# Altium project Module_Input_BME280.PrjPcb
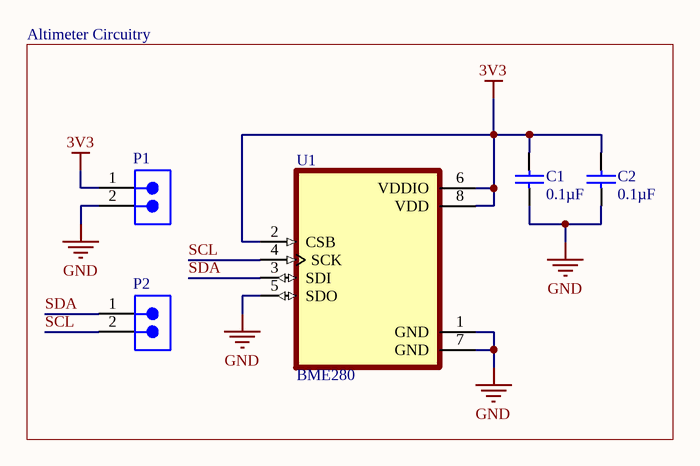
[diagram p0: Schematic.SchDoc]
1 sheet, 5 parts. Net scope: global (net labels, ports and power ports of the same name join across sheets).
Board file: PCB.PcbDoc

## Sheet Schematic.SchDoc
size A; SheetNumber: 1; SheetTotal: 1

### Parts
C1  0.1µF  [CAPC3216X100X50LL20T25]
C2  0.1µF  [CAPC3216X100X50LL20T25]
P1  61300211121  [61300211121]  (value not drawn)
P2  61300211121  [61300211121]  (value not drawn)
U1  BME280  [PSON65P250X250X100-8N]

### Blocks framed on the sheet
Altimeter Circuitry: C1 C2 P1 P2 U1

### Nets
3V3: C1.1 C2.1 P1.1 U1.2(CSB) U1.6(VDDIO) U1.8(VDD)
GND: C1.2 C2.2 P1.2 U1.1(GND) U1.5(SDO) U1.7(GND)
SCL: P2.2 U1.4(SCK)
SDA: P2.1 U1.3(SDI)

### Library data of the parts
C1 C2 = CMP-1664-00001-4: Chip Capacitor, 100 nF, +/- 10%, 25 V, -55 to 125 degC, 1206 (3216 Metric), RoHS, Tape and Reel; Manufacturer: Kemet; Voltage Rating: 25 V; ComponentLink1URL: http://www.kemet.com/; Max Operating Temperature: 125 degC; PackageReference: 1206; ComponentLink2URL: http://www.kemet.com/docfinder?Partnumber=C1206F104K3RACTU; ComponentLink1Description: Manufacturer URL; ComponentLink2Description: Datasheet; Length: 3.2 mm; Packaging: Tape and Reel; Height: 0.78 mm; Mounting Technology: Surface Mount; REACH SVHC: No SVHC; PackageDescription: 2-Pin Surface Mount Device, Body 3.2 x 1.6 mm; Min Operating Temperature: -55 degC; RoHSCompliant: true; DatasheetVersion: 02/2016; Package Quantity: 4000
P1 P2 = CMP-1712-00002-6: NexarPartId: 20081794; Number of Contacts: 2; Pitch: 2.54mm; Connector Type: Male Pin; Voltage Rating: 250V; Current Rating: 3A; Gender: Male; Contact Resistance: 20mΩ; Height: 8.94mm; Lead Free: Lead Free; Number of Pins: 2; Termination: Through Hole; RoHS: Compliant; Lead Pitch: 2.54mm; REACH SVHC: No SVHC; Housing Material: PBT; Contact Mating Length: 5.9944mm; Min Operating Temperature: -40°C; Orientation: Vertical; Contact Material: Copper; Contact Gender: Male; Max Operating Temperature: 125°C; Number of Rows: 1; Number of Positions: 2; Packaging: Bulk; Contact Plating: Gold; Mount: Through Hole; Color: Black; Operating Supply Voltage: 250V
U1 = BME280: DIGITAL HUMIDITY, PRESSURE AND TEMPERATURE SENSOR<br>* Digital interface IÂ²C (up to 3.4 MHz) and SPI (3 and 4 wire, up to 10 MHz)* Supply voltage VDD main supply voltage range: 1.71 V to 3.6 V*VDDIO interface voltage range: 1.2 V to 3.6 V<br> Operating range -40â€¦+85 Â°C, 0â€¦100 % rel. humidity, 300â€¦1100 hPa <br><br>  The library has been designed by<a href="https://www.facebook.com/groups/eaglecadsoftUK"> Richard Magdycz</a>; Package: None; Availability: Unavailable; MP: BME280; Value: *; Price: None